# Altium schematic sheet Power3.SchDoc
size A3
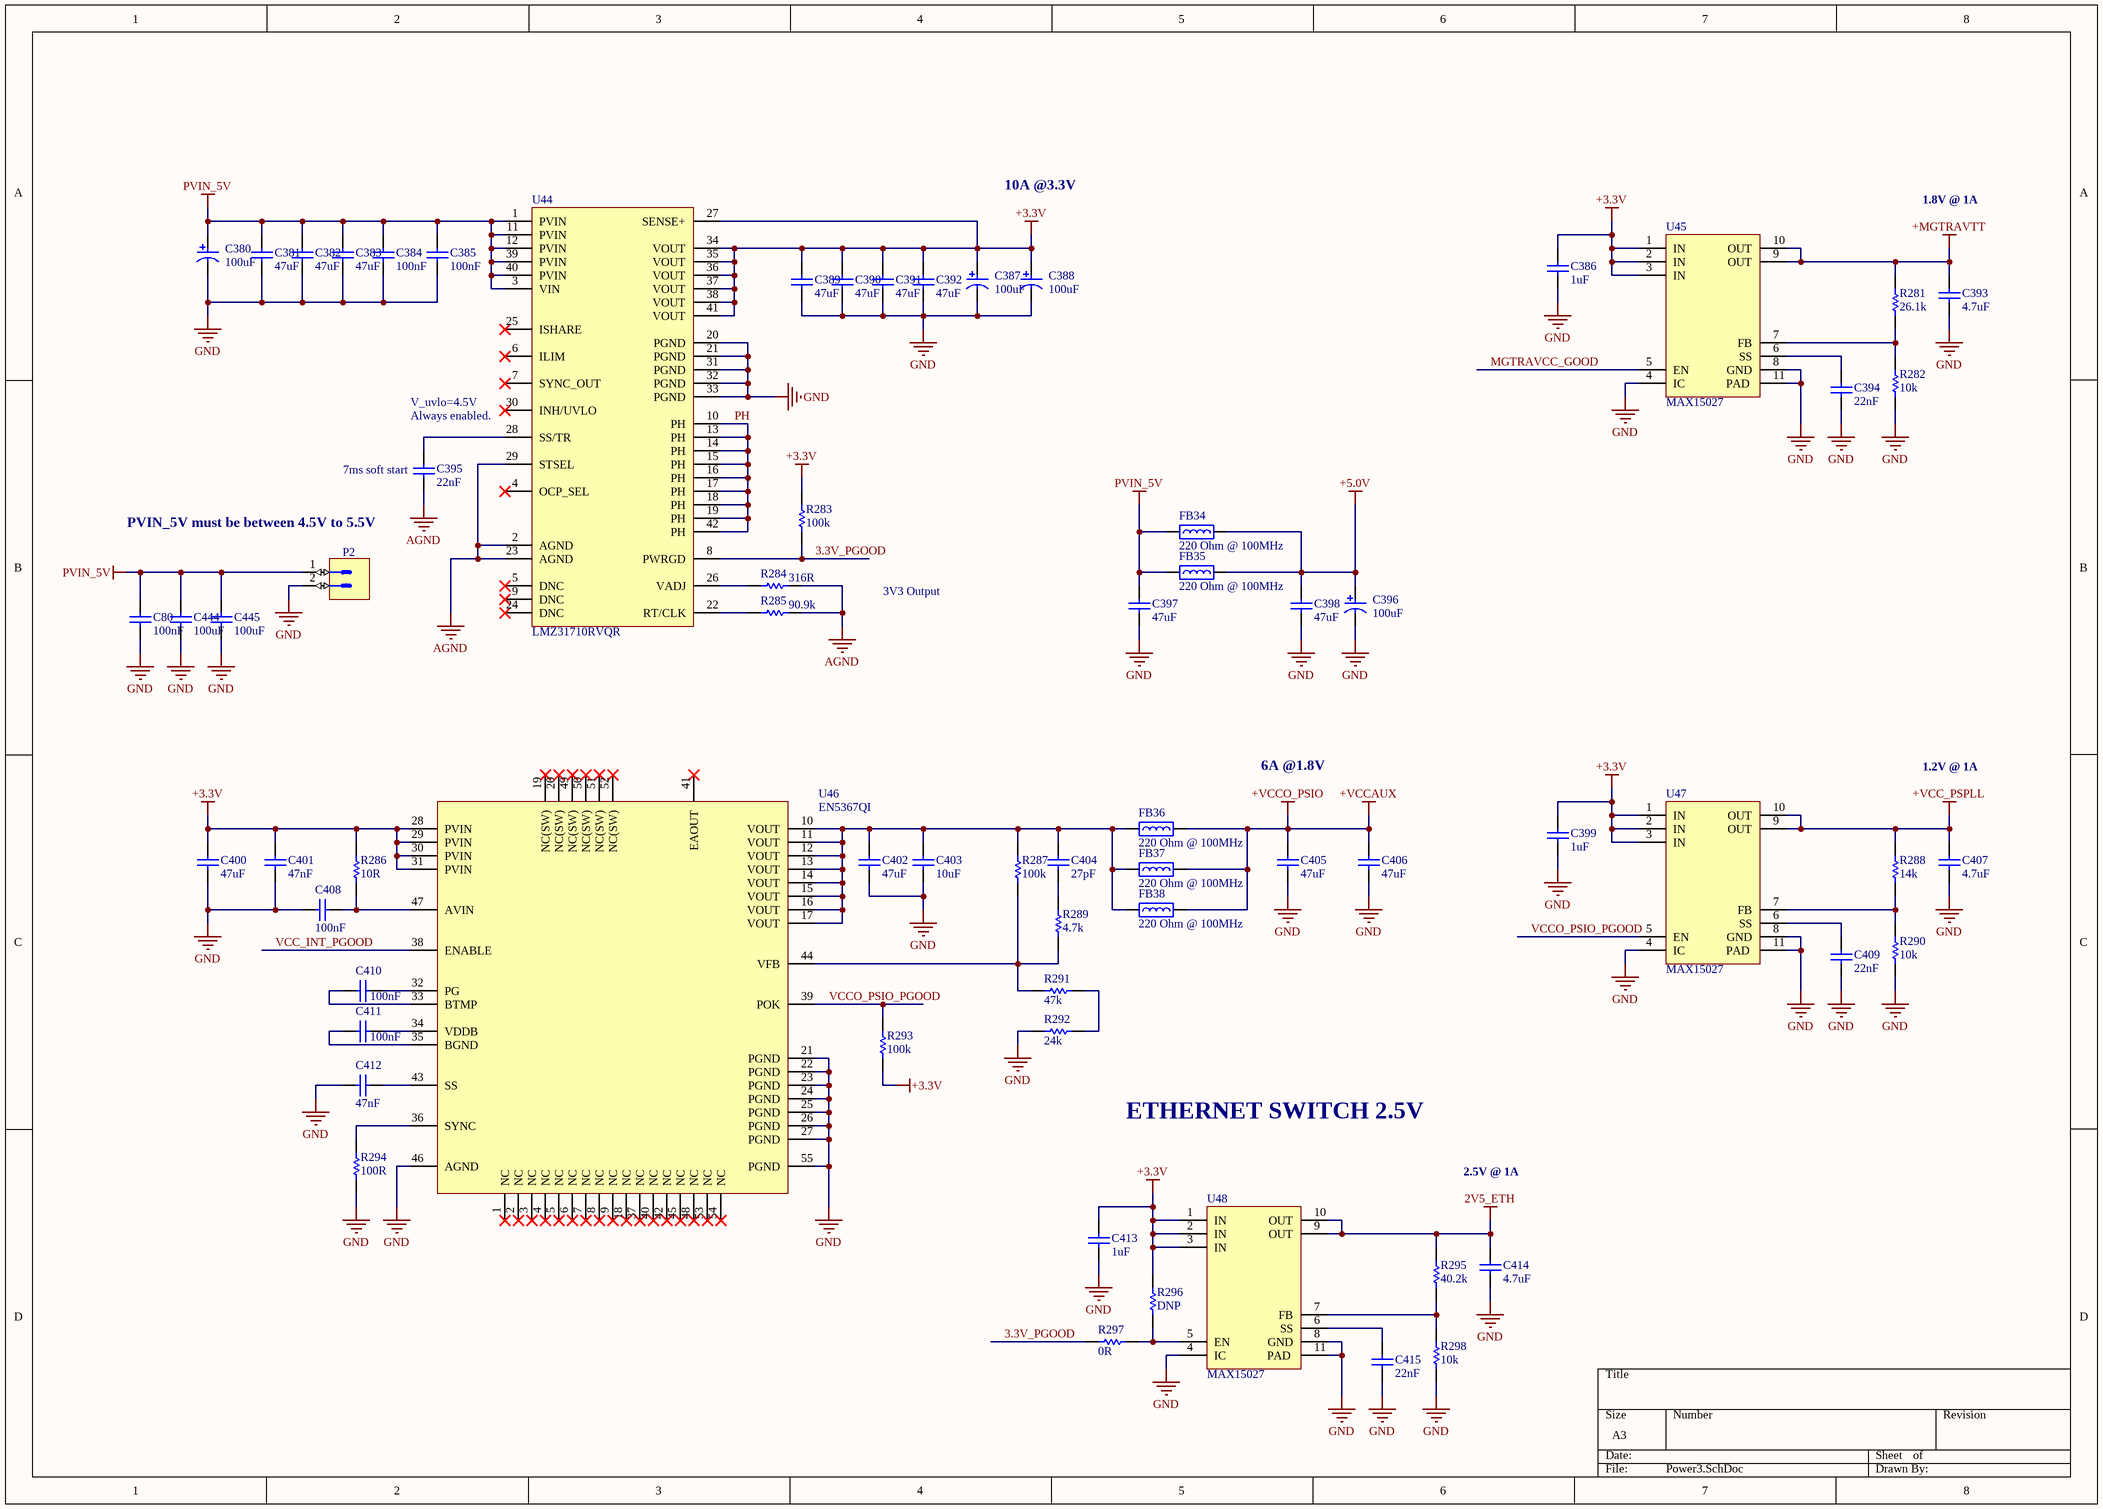
[diagram p0: Power3.SchDoc]

## Parts
C80  100nF  [CAPC1005L_0402]
C380  100uF  [AVX_TAN_F95_P_0905]
C381  47uF  [CAPC3216L_1206]
C382  47uF  [CAPC3216L_1206]
C383  47uF  [CAPC3216L_1206]
C384  100nF  [CAPC1005L_0402]
C385  100nF  [CAPC1005L_0402]
C386  1uF  [CAPC1005L_0402]
C387  100uF  [AVX_TAN_F95_P_0905]
C388  100uF  [AVX_TAN_F95_P_0905]
C389  47uF  [CAPC3216L_1206]
C390  47uF  [CAPC3216L_1206]
C391  47uF  [CAPC3216L_1206]
C392  47uF  [CAPC3216L_1206]
C393  4.7uF  [CAPC1005L_0402]
C394  22nF  [CAPC1005L_0402]
C395  22nF  [CAPC1005L_0402]
C396  100uF  [AVX_TAN_F95_P_0905]
C397  47uF  [CAPC3216L_1206]
C398  47uF  [CAPC3216L_1206]
C399  1uF  [CAPC1005L_0402]
C400  47uF  [CAPC3216L_1206]
C401  47nF  [CAPC2012L_0805]
C402  47uF  [CAPC3216L_1206]
C403  10uF  [CAPC1005L_0402]
C404  27pF  [CAPC1005L_0402]
C405  47uF  [CAPC3216L_1206]
C406  47uF  [CAPC3216L_1206]
C407  4.7uF  [CAPC1005L_0402]
C408  100nF  [CAPC1005L_0402]
C409  22nF  [CAPC1005L_0402]
C410  100nF  [CAPC1005L_0402]
C411  100nF  [CAPC1005L_0402]
C412  47nF  [CAPC2012L_0805]
C413  1uF  [CAPC1005L_0402]
C414  4.7uF  [CAPC1005L_0402]
C415  22nF  [CAPC1005L_0402]
C444  100uF  [CAPC3225N_1210]
C445  100uF  [CAPC3225N_1210]
FB34  Impedance @ Frequency: 220 Ohm @ 100MHz  [INDC1608N_0603]  (hidden comment: BEAD0603_220_2A5_40M)
FB35  Impedance @ Frequency: 220 Ohm @ 100MHz  [INDC1608N_0603]  (hidden comment: BEAD0603_220_2A5_40M)
FB36  Impedance @ Frequency: 220 Ohm @ 100MHz  [INDC1608N_0603]  (hidden comment: BEAD0603_220_2A5_40M)
FB37  Impedance @ Frequency: 220 Ohm @ 100MHz  [INDC1608N_0603]  (hidden comment: BEAD0603_220_2A5_40M)
FB38  Impedance @ Frequency: 220 Ohm @ 100MHz  [INDC1608N_0603]  (hidden comment: BEAD0603_220_2A5_40M)
P2  KK®  [MOLEX_26-60-4020]  (value not drawn)
R281  value 26.1k  [RESC1005L_0402]  (hidden comment: RES0402_26K1_0W1_1T)
R282  value 10k  [RESC1005L_0402]  (hidden comment: RES0402_10K_0W1_05T)
R283  value 100k  [RESC1005L_0402]  (hidden comment: RES0402_100K_0W2_1T)
R284  value 316R  [RESC1005L_0402]  (hidden comment: RES0402_316R_0W06_1T)
R285  value 90.9k  [RESC1005L_0402]  (hidden comment: RES0402_90K9_0W1_1T)
R286  value 10R  [RESC1005L_0402]  (hidden comment: RES0402_10R_0W1_1T)
R287  value 100k  [RESC1005L_0402]  (hidden comment: RES0402_100K_0W2_1T)
R288  value 14k  [RESC1005L_0402]  (hidden comment: RES0402_14K_0W1_1T)
R289  value 4.7k  [RESC1005L_0402]  (hidden comment: RES0402_4K7_0W1_1T)
R290  value 10k  [RESC1005L_0402]  (hidden comment: RES0402_10K_0W1_05T)
R291  value 47k  [RESC1005L_0402]  (hidden comment: RES0402_47K_0W1)
R292  value 24k  [RESC1005L_0402]  (hidden comment: RES0402_24K_0W1)
R293  value 100k  [RESC1005L_0402]  (hidden comment: RES0402_100K_0W2_1T)
R294  value 100R  [RESC1005L_0402]  (hidden comment: RES0402_100R_0W1_1T)
R295  value 40.2k  [RESC1005L_0402]  (hidden comment: RES0402_40K2_0W1_1T)
R296  value DNP  [RESC1005L_0402]  (hidden comment: RES0402)
R297  value 0R  [RESC1005L_0402]  (hidden comment: RES0402_0R)
R298  value 10k  [RESC1005L_0402]  (hidden comment: RES0402_10K_0W1_05T)
U44  LMZ31710RVQR  [LMZ31710RVQR]
U45  MAX15027  [MAX15027_T1033+1_V]
U46  EN5367QI  [QFN54-EN5367QI]
U47  MAX15027  [MAX15027_T1033+1_V]
U48  MAX15027  [MAX15027_T1033+1_V]

## Nets
2V5_ETH: C414.2 R295.2 U48.9(OUT) U48.10(OUT)
+3.3V: C386.2 C387.1 C388.1 C389.2 C390.2 C391.2 C392.2 C399.2 C400.2 C401.2 C413.2 R283.2 R286.2 R293.2 R296.2 U44.27(SENSE+) U44.34(VOUT) U44.35(VOUT) U44.36(VOUT) U44.37(VOUT) U44.38(VOUT) U44.41(VOUT) U45.1(IN) U45.2(IN) U45.3(IN) U46.28(PVIN) U46.29(PVIN) U46.30(PVIN) U46.31(PVIN) U47.1(IN) U47.2(IN) U47.3(IN) U48.1(IN) U48.2(IN) U48.3(IN)
+5.0V: C396.1 C398.2 FB34.2 FB35.2
+MGTRAVTT: C393.2 R281.2 U45.9(OUT) U45.10(OUT)
+VCC_PSPLL: C407.2 R288.2 U47.9(OUT) U47.10(OUT)
+VCCAUX: C405.2 C406.2 FB36.2 FB37.2 FB38.2  [also labelled +VCCO_PSIO]
AGND: C395.1 R284.2 R285.2 U44.2(AGND) U44.23(AGND) U44.29(STSEL)
GND: C80.2 C380.2 C381.1 C382.1 C383.1 C384.2 C385.2 C386.1 C387.2 C388.2 C389.1 C390.1 C391.1 C392.1 C393.1 C394.1 C396.2 C397.1 C398.1 C399.1 C400.1 C401.1 C402.1 C403.1 C405.1 C406.1 C407.1 C408.2 C409.1 C412.2 C413.1 C414.1 C415.1 C444.1 C445.1 P2.2 R282.1 R290.1 R292.1 R294.2 R298.1 U44.20(PGND) U44.21(PGND) U44.31(PGND) U44.32(PGND) U44.33(PGND) U45.4(IC) U45.8(GND) U45.11(PAD) U46.21(PGND) U46.22(PGND) U46.23(PGND) U46.24(PGND) U46.25(PGND) U46.26(PGND) U46.27(PGND) U46.46(AGND) U46.55(PGND) U47.4(IC) U47.8(GND) U47.11(PAD) U48.4(IC) U48.8(GND) U48.11(PAD)
PVIN_5V: C80.1 C380.1 C381.2 C382.2 C383.2 C384.1 C385.1 C397.2 C444.2 C445.2 FB34.1 FB35.1 P2.1 U44.1(PVIN) U44.3(VIN) U44.11(PVIN) U44.12(PVIN) U44.39(PVIN) U44.40(PVIN)
3.3V_PGOOD: R283.1 R297.1 U44.8(PWRGD)
MGTRAVCC_GOOD: U45.5(EN)
PH: U44.10(PH) U44.13(PH) U44.14(PH) U44.15(PH) U44.16(PH) U44.17(PH) U44.18(PH) U44.19(PH) U44.42(PH)
VCC_INT_PGOOD: U46.38(ENABLE)
VCCO_PSIO_PGOOD: R293.1 U46.39(POK) U47.5(EN)
NetC394_2: C394.2 U45.6(SS)
NetC395_2: C395.2 U44.28(SS/TR)
NetC402_2: C402.2 C403.2 C404.2 FB36.1 FB37.1 FB38.1 R287.2 U46.10(VOUT) U46.11(VOUT) U46.12(VOUT) U46.13(VOUT) U46.14(VOUT) U46.15(VOUT) U46.16(VOUT) U46.17(VOUT)
NetC404_1: C404.1 R289.2
NetC408_1: C408.1 R286.1 U46.47(AVIN)
NetC409_2: C409.2 U47.6(SS)
NetC410_1: C410.1 U46.32(PG)
NetC410_2: C410.2 U46.33(BTMP)
NetC411_1: C411.1 U46.34(VDDB)
NetC411_2: C411.2 U46.35(BGND)
NetC412_1: C412.1 U46.43(SS)
NetC415_2: C415.2 U48.6(SS)
NetR281_1: R281.1 R282.2 U45.7(FB)
NetR284_1: R284.1 U44.26(VADJ)
NetR285_1: R285.1 U44.22(RT/CLK)
NetR287_1: R287.1 R289.1 R291.2 U46.44(VFB)
NetR288_1: R288.1 R290.2 U47.7(FB)
NetR291_1: R291.1 R292.2
NetR294_1: R294.1 U46.36(SYNC)
NetR295_1: R295.1 R298.2 U48.7(FB)
NetR296_1: R296.1 R297.2 U48.5(EN)

Not connected (* = marked no-connect by the designer): U44 4(OCP_SEL)* 5(DNC)* 6(ILIM)* 7(SYNC_OUT)* 9(DNC)* 24(DNC)* 25(ISHARE)* 30(INH/UVLO)*; U46 1(NC)* 2(NC)* 3(NC)* 4(NC)* 5(NC)* 6(NC)* 7(NC)* 8(NC)* 9(NC)* 18(NC)* 19(NC(SW))* 20(NC(SW))* 37(NC)* 40(NC)* 41(EAOUT)* 42(NC)* 45(NC)* 48(NC)* 49(NC(SW))* 50(NC(SW))* 51(NC(SW))* 52(NC(SW))* 53(NC)* 54(NC)*

## Notes on the sheet
- 10A @3.3V
- 1.8V @ 1A
- V_uvlo=4.5V
- Always enabled.
- (near C395) 7ms soft start
- PVIN_5V must be between 4.5V to 5.5V
- 3V3 Output
- 6A @1.8V
- 1.2V @ 1A
- ETHERNET SWITCH 2.5V
- 2.5V @ 1A

## Library data of the parts
C80 C384 C385 C408 C410 C411 = CAPCER0402X7R100N25V_10T: CAP CER 0.1UF 25V X7R 0402; Manufacturer 1: Murata Electronics North America; Manufacturer Part Number 1: GRM155R71E104KE14D; Tolerance: 10%; Package: 0402; ComponentLink1Description: Datasheet; Value: 100nF; Voltage: 25V; Temperature Coefficient: X7R; Supplier 1: Digi-Key; Supplier Part Number 1: 490-10698-1-ND; Operating Temperature: -55°C ~ 125°C
C380 C387 C388 C396 = CAPELE0905TAN100U6V3_20T: CAP TANT 100UF 6.3V 20% 0805; Manufacturer 1: AVX Corporation; Manufacturer Part Number 1: F950J107MPAAQ2; Temperature Coefficient: Tantalum; ESR: 1.2 Ohm; Package: 0905 P; ComponentLink1Description: Datasheet; ComponentLink1URL: C:\Users\Public\Documents\Altium\AD16\Library\PDF\F95.pdf; Value: 100uF; Voltage: 6.3V; Tolerance: 20%; Supplier 1: Digi-Key; Supplier Part Number 1: 478-8393-1-ND; Operating Temperature: -55°C ~ 125°C
C381-C383 C389-C392 C397 C398 C400 C402 C405 C406 = CAPCER1206X5R47U25V_20T: CAP CER 47UF 25V X5R 1206; Manufacturer 1: TDK Corporation; Manufacturer Part Number 1: C3216X5R1E476M160AC; Tolerance: 20%; Package: 1206; ComponentLink1Description: Datasheet; Value: 47uF; Voltage: 25V; Temperature Coefficient: X5R; Supplier 1: Digi-Key; Supplier Part Number 1: 445-8047-1-ND; Operating Temperature: -55°C ~ 85°C
C386 C399 C413 = CAPCER0402X5R1U16V_20T: CAP CER 1UF 16V X5R 0402; Manufacturer 1: Murata Electronics North America; Manufacturer Part Number 1: GRM155R61C105ME01D; Tolerance: 20%; Package: 0402; ComponentLink1Description: Datasheet; Value: 1uF; Voltage: 16V; Temperature Coefficient: X5R; Supplier 1: Digi-Key; Supplier Part Number 1: 490-10454-1-ND; Operating Temperature: -55°C ~ 85°C
C393 C407 C414 = CAPCER0402X5R4U710V_10T: CAP CER 4.7UF 10V X5R 0402; Manufacturer 1: TDK Corporation; Manufacturer Part Number 1: C1005X5R1A475K050BC; Tolerance: 10%; Package: 0402; ComponentLink1Description: Datasheet; Value: 4.7uF; Voltage: 10V; Temperature Coefficient: x5R; Supplier 1: Digi-Key; Supplier Part Number 1: 445-13820-1-ND; Operating Temperature: -55°C ~ 85°C
C394 C395 C409 C415 = CAPCER0402X7R22N50V_10T: CAP CER 0.022UF 50V X7R 0402; Manufacturer 1: Murata Electronics North America; Manufacturer Part Number 1: GRM155R71H223KA12D; Tolerance: 10%; Package: 0402; ComponentLink1Description: Datasheet; Value: 22nF; Voltage: 50V; Temperature Coefficient: X7R; Supplier 1: Digi-Key; Supplier Part Number 1: 490-3884-1-ND; Operating Temperature: -55°C ~ 125°C
C401 C412 = CAPCER0805X5R47N50V_10T: CAP CER 0.047UF 50V X7R 0805; Manufacturer 1: Kemet; Manufacturer Part Number 1: C0805C473K5RACTU; Tolerance: 10%; Package: 0805; ComponentLink1Description: Datasheet; Value: 47nF; Voltage: 50V; Temperature Coefficient: X7R; Supplier 1: Digi-Key; Supplier Part Number 1: 399-1166-1-ND; Operating Temperature: -55°C ~ 125°C
C403 = CAPCER0402X5R10U10V_20T: CAP CER 10UF 10V X5R 0402; Manufacturer 1: Samsung Electro-Mechanics America, Inc.; Manufacturer Part Number 1: CL05A106MP5NUNC; Tolerance: 20%; Package: 0402; ComponentLink1Description: Datasheet; Value: 10uF; Voltage: 10V; Temperature Coefficient: X5R; Supplier 1: Digi-Key; Supplier Part Number 1: 1276-1450-1-ND; Operating Temperature: -55°C ~ 85°C
C404 = CAPCER0402C0G27P50V_5T: CAP CER 27PF 50V C0G/NP0 0402; Manufacturer 1: Murata Electronics North America; Manufacturer Part Number 1: GRM1555C1H270JA01D; Tolerance: 5%; Package: 0402; ComponentLink1Description: Datasheet; Value: 27pF; Voltage: 50V; Temperature Coefficient: C0G/NP0; Supplier 1: Digi-Key; Supplier Part Number 1: 490-5869-1-ND; Operating Temperature: -55°C ~ 125°C
C444 C445 = CAPCER1210X5R100U16V_20T: CAP CER 100UF 16V X5R 1210; Manufacturer 1: Taiyo Yuden; Manufacturer Part Number 1: EMK325ABJ107MM-T; Tolerance: 20%; Package: 1210; ComponentLink1Description: Datasheet; Value: 100uF; Voltage: 16V; Temperature Coefficient: X5R; Supplier 1: Digi-Key; Supplier Part Number 1: 587-3152-1-ND; Operating Temperature: -55°C ~ 85°C
FB34-FB38 = BEAD0603_220_2A5_40M: FERRITE BEAD 220 OHM 0603 1LN; Manufacturer 1: Murata Electronics North America; Manufacturer Part Number 1: BLM18SG221TN1D; Current Rating (Max): 2.5A; DC Resistance (DCR) (Max): 40 mohm; Package: 0603; ComponentLink1Description: Datasheet; ComponentLink1URL: C:\Users\Public\Documents\Altium\AD16\Library\PDF\ENFA0003.pdf; Supplier 1: Digi-Key; Supplier Part Number 1: 490-5225-1-ND; Operating Temperature: -55°C ~ 125°C
P2 = MOLEX_26-60-4020: Connector 2 Male; Part Description: 3.96mm (.156") Pitch KK® Solid Header, Vertical, Friction Lock, 2 Circuits, Tin (Sn) Plating; Manufacturer: Molex, LLC; Manufacturer Part Number: 0026604020; Table: MOLEX; Number of Positions: 2; Connector Type: Header, Unshrouded; Pitch: 0.156" (3.96mm); Number of Positions Loaded: All; Part Number: MOLEX_26-60-4020; Component Kind: Standard; Component Type: Standard; Pin Count: 2; Family: KK®; Mounted: Yes; Socket: No; SMD: No; Status: None; ComponentHeight: 14.73mm; HelpURL: \\cern.ch\dfs\Applications\Altium\Datasheets\MOLEX_26-60-4020.pdf; Author: CERN DEM JLC; CreateDate: 6.04.2011; LatestRevisionDate: 6.04.2011; Contact Mating Length: 0.450" (11.43mm); Termination: Solder; Fastening Type: Friction Lock; Supplier Part Number: WM4620-ND; Contact Finish Thickness: 60µin (1.52µm); Mounting Type: Through Hole; Contact Type: Male Pin; Row Spacing: -; Supplier: Digi-Key; Contact Finish: Tin; Number of Rows: 1; RoHS: RoHS Compliant; Packaging: Bulk; Category: Connectors, Interconnects; Features: -; Color: Natural
R281 = RES0402_26K1_0W1_1T: RES SMD 26.1K OHM 1% 1/10W 0402; Manufacturer 1: Panasonic Electronic Components; Manufacturer Part Number 1: ERJ-2RKF2612X; Package: 0402; ComponentLink1Description: Datasheet; Power: 1/10W; Tolerance: 1%; Supplier 1: Digi-Key; Supplier Part Number 1: P26.1KLCT-ND
R282 R290 R298 = RES0402_10K_0W1_05T: RES SMD 10K OHM 0.5% 1/16W 0402; Manufacturer 1: Panasonic Electronic Components; Manufacturer Part Number 1: ERJ-2RHD1002X; Package: 0402; ComponentLink1Description: Datasheet; Power: 1/16W; Tolerance: 0.5%; Supplier 1: Digi-Key; Supplier Part Number 1: P15984CT-ND
R283 R287 R293 = RES0402_100K_0W2_1T: RES SMD 100K OHM 1% 1/5W 0402; Manufacturer 1: Vishay Dale; Manufacturer Part Number 1: RCS0402100KFKED; Package: 0402; ComponentLink1Description: Datasheet; Power: 1/5W; Tolerance: 1%; Supplier 1: Digi-Key; Supplier Part Number 1: 541-2899-1-ND
R284 = RES0402_316R_0W06_1T: RES SMD 316 OHM 1% 1/16W 0402; Manufacturer 1: Vishay Dale; Manufacturer Part Number 1: CRCW0402316RFKED; Package: 0402; ComponentLink1Description: Datasheet; Power: 1/16W; Tolerance: 1%; Supplier 1: Digi-Key; Supplier Part Number 1: 541-316LCT-ND
R285 = RES0402_90K9_0W1_1T: RES SMD 90.9K OHM 1% 1/10W 0402; Manufacturer 1: Panasonic Electronic Components; Manufacturer Part Number 1: ERJ-2RKF9092X; Package: 0402; ComponentLink1Description: Datasheet; Power: 1/10W; Tolerance: 1%; Supplier 1: Digi-Key; Supplier Part Number 1: P90.9KLCT-ND
R286 = RES0402_10R_0W1_1T: RES SMD 10 OHM 1% 1/10W 0402; Manufacturer 1: Panasonic Electronic Components; Manufacturer Part Number 1: ERJ-2RKF10R0X; Package: 0402; ComponentLink1Description: Datasheet; Power: 1/10W; Tolerance: 1%; Supplier 1: Digi-Key; Supplier Part Number 1: P10.0LCT-ND
R288 = RES0402_14K_0W1_1T: RES SMD 14K OHM 1% 1/10W 0402; Manufacturer 1: Panasonic Electronic Components; Manufacturer Part Number 1: ERJ-2RKF1402X; Package: 0402; ComponentLink1Description: Datasheet; Power: 1/10W; Tolerance: 1%; Supplier 1: Digi-Key; Supplier Part Number 1: P14.0KLCT-ND
R289 = RES0402_4K7_0W1_1T: RES SMD 4.7K OHM 1% 1/10W 0402; Manufacturer 1: Panasonic Electronic Components; Manufacturer Part Number 1: ERJ-2RKF4701X; Package: 0402; ComponentLink1Description: Datasheet; Power: 1/10W; Tolerance: 1%; Supplier 1: Digi-Key; Supplier Part Number 1: P4.70KLCT-ND
R291 = RES0402_47K_0W1: RES SMD 47K OHM 1% 1/10W 0402; Manufacturer 1: Panasonic Electronic Components; Manufacturer Part Number 1: ERJ-2RKF4702X; Package: 0402; ComponentLink1Description: Datasheet; Power: 1/10W; Tolerance: 1%; Supplier 1: Digi-Key; Supplier Part Number 1: P47.0KLCT-ND
R292 = RES0402_24K_0W1: RES SMD 24K OHM 1% 1/10W 0402; Manufacturer 1: Panasonic Electronic Components; Manufacturer Part Number 1: ERJ-2RKF2402X; Package: 0402; ComponentLink1Description: Datasheet; Power: 1/10W; Tolerance: 1%; Supplier 1: Digi-Key; Supplier Part Number 1: P24.0KLCT-ND
R294 = RES0402_100R_0W1_1T: RES SMD 100 OHM 1% 1/10W 0402; Manufacturer 1: Panasonic Electronic Components; Manufacturer Part Number 1: ERJ-2RKF1000X; Package: 0402; ComponentLink1Description: Datasheet; Power: 1/10W; Tolerance: 1%; Supplier 1: Digi-Key; Supplier Part Number 1: P100LCT-ND
R295 = RES0402_40K2_0W1_1T: RES SMD 40.2K OHM 1% 1/10W 0402; Manufacturer 1: Panasonic Electronic Components; Manufacturer Part Number 1: ERJ-2RKF4022X; Package: 0402; ComponentLink1Description: Datasheet; Power: 1/10W; Tolerance: 1%; Supplier 1: Digi-Key; Supplier Part Number 1: P40.2KLCT-ND
R296 = RES0402: RES SMD 0402 Footprint; Package: 0402; ComponentLink1Description: Datasheet; Tolerance: -
R297 = RES0402_0R: RES SMD 0 OHM JUMPER 1/16W 0402; Manufacturer 1: Vishay Dale; Manufacturer Part Number 1: CRCW04020000Z0ED; Power: 0.063W, 1/16W; Package: 0402; ComponentLink1Description: Datasheet; Tolerance: -; Supplier 1: Digi-Key; Supplier Part Number 1: 541-0.0JCT-ND
U44 = LMZ31710RVQR: DC/DC CONVERTER 0.6-5.5V 55W; Manufacturer 1: Texas Instruments; ComponentLink1Description: Datasheet; ComponentLink1URL: C:\Users\Public\Documents\Altium\AD16\Library\PDF\lmz31710.pdf; Manufacturer Part Number 1: LMZ31710RVQR; Supplier 1: Digikey; Supplier Part Number 1: 296-43646-1-ND; Operating Temperature: -40°C ~ 85°C
U45 U47 U48 = MAX15027: IC REG LINEAR POS ADJ 1A 10TDFN; Manufacturer 1: Maxim Integrated; Manufacturer Part Number 1: MAX15027ATB+T; ComponentLink1Description: Datasheet; ComponentLink1URL: C:\Users\Public\Documents\Altium\AD16\Library\PDF\MAX15027-MAX15028.pdf; Supplier 1: Digi-Key; Supplier Part Number 1: MAX15027ATB+TCT-ND; Operating Temperature: -40°C ~ 125°C
U46 = EN5367QI: DC/DC CONVERTER 0.6-4.9V 29W; Manufacturer 1: Altera; Voltage - Output: 0.6 ~ 4.9 V; Voltage - Input: 2.5V - 5.5V; ComponentLink1Description: Datasheet; ComponentLink1URL: C:\Users\Public\Documents\Altium\AD16\Library\PDF\en5367qi_07013.pdf; Supplier 1: Digi-Key; Supplier Part Number 1: 544-2858-1-ND; Manufacturer Part Number 1: EN5367QI; Operating Temperature: -40°C ~ 85°C